# Altium schematic sheet coils.SchDoc
size A
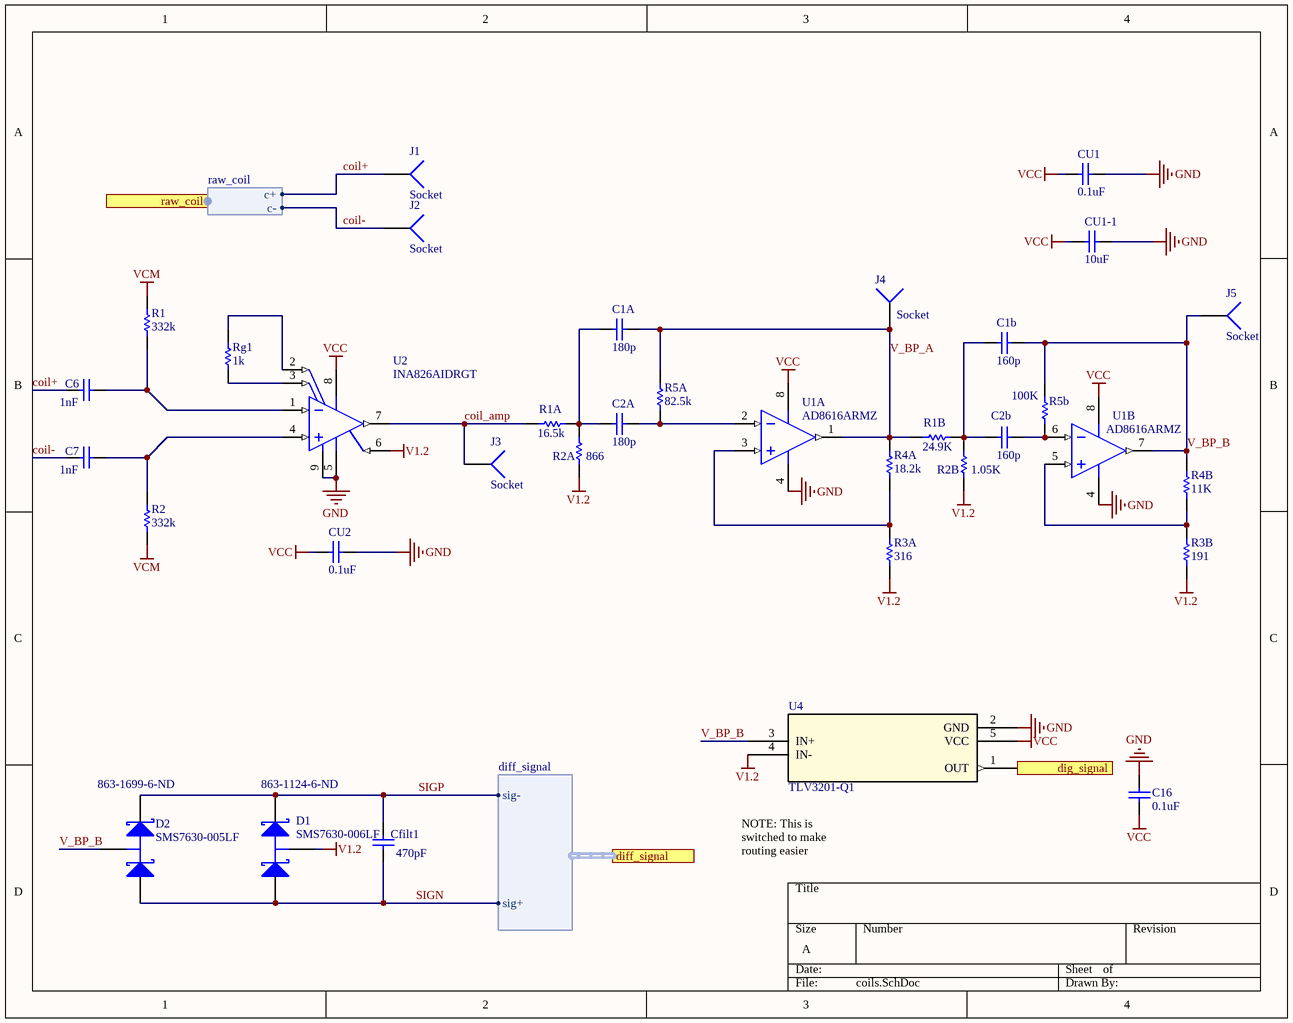
[diagram p0: coils.SchDoc]

## Parts
C1A  value 180p  [0402]  (hidden comment: Cap)
C1b  value 160p  [0402]  (hidden comment: Cap)
C2A  value 180p  [0402]  (hidden comment: Cap)
C2b  value 160p  [0402]  (hidden comment: Cap)
C6  value 1nF  [0402]  (hidden comment: Cap)
C7  value 1nF  [0402]  (hidden comment: Cap)
C16  value 0.1uF  [0402]  (hidden comment: Cap)
Cfilt1  value 470pF  [0402]  (hidden comment: Cap)
CU1  value 0.1uF  [0402]  (hidden comment: Cap)
CU1-1  value 10uF  [0402]  (hidden comment: Cap)
CU2  value 0.1uF  [0402]  (hidden comment: Cap)
D1  SMS7630-006LF  Supplier Part Number 1: 863-1124-6-ND  [SOT23-3N]
D2  SMS7630-005LF  Supplier Part Number 1: 863-1699-6-ND  [SOT23-3N]
J1  Socket  [pin1]
J2  Socket  [pin1]
J3  Socket  [pin1]
J4  Socket  [pin1]
J5  Socket  [pin1]
R1  value 332k  [0402]  (hidden comment: Res)
R1A  value 16.5k  [0402]  (hidden comment: Res)
R1B  value 24.9K  [0402]  (hidden comment: Res)
R2  value 332k  [0402]  (hidden comment: Res)
R2A  value 866  [0402]  (hidden comment: Res)
R2B  value 1.05K  [0402]  (hidden comment: Res)
R3A  value 316  [0402]  (hidden comment: Res)
R3B  value 191  [0402]  (hidden comment: Res)
R4A  value 18.2k  [0402]  (hidden comment: Res)
R4B  value 11K  [0402]  (hidden comment: Res)
R5A  value 82.5k  [0402]  (hidden comment: Res)
R5b  value 100K  [0402]  (hidden comment: Res)
Rg1  value 1k  [0402]  (hidden comment: Res)
U1  AD8616ARMZ  [ADI-RM-8_N]  (parts A,B of 2)
U2  INA826AIDRGT  [DRG0008A_V]
U4  TLV3201-Q1  [SOT95P280X145-5N]

## Ports
diff_signal (harness diff_signal), dig_signal (out), raw_coil (harness raw_coil)

## Harnesses
raw_coil: c-, c+
diff_signal: sig+, sig-

## Nets
GND: C16.2 CU1.1 CU1-1.1 CU2.1 U1.4(-V) U2.5(VS-) U2.9(EP) U4.2(GND)
V1.2: D1.3(C) R2A.1 R2B.1 R3A.2 R3B.1 U2.6(REF) U4.4(IN-)
VCC: C16.1 CU1.2 CU1-1.2 CU2.2 U1.8(+V) U2.8(VS+) U4.5(VCC)
VCM: R1.2 R2.1
coil+: C6.1 J1.1 ; port raw_coil.c+
coil-: C7.1 J2.1 ; port raw_coil.c-
coil_amp: J3.1 R1A.1 U2.7(VOUT)
dig_signal: U4.1(OUT) ; port dig_signal
SIGN: Cfilt1.1 D1.2(K) D2.1(A) ; port diff_signal.sig+
SIGP: Cfilt1.2 D1.1(A) D2.2(K) ; port diff_signal.sig-
V_BP_A: C1A.2 J4.1 R1B.1 R4A.1 R5A.1 U1.1(OUT_A)
V_BP_B: C1b.2 D2.3(C) J5.1 R4B.2 R5b.1 U1.7(OUT_B) U4.3(IN+)
NetC1A_1: C1A.1 C2A.1 R1A.2 R2A.2
NetC1b_1: C1b.1 C2b.1 R1B.2 R2B.2
NetC2A_2: C2A.2 R5A.2 U1.2(-IN_A)
NetC2b_2: C2b.2 R5b.2 U1.6(-IN_B)
NetC6_2: C6.2 R1.1 U2.1(IN-)
NetC7_2: C7.2 R2.2 U2.4(IN+)
NetR3A_1: R3A.1 R4A.2 U1.3(+IN_A)
NetR3B_2: R3B.2 R4B.1 U1.5(+IN_B)
NetRg1_1: Rg1.1 U2.2(RG)
NetRg1_2: Rg1.2 U2.3(RG)

## Notes on the sheet
- (near U4) NOTE: This is switched to make routing easier

## Library data of the parts
C1A C1b C2A C2b C6 C7 C16 Cfilt1 CU1 CU1-1 CU2 = Cap: Ceramic Capacitor (Surface Mount); Manufacturer: Generic Ceramic Chip Cap (TBD)
  C1A C1b C2A C2b C16 Cfilt1 CU1 CU1-1 CU2: Digi-Key Part Number: *; Manufacturer Part Number: *; Note: *; Rating: *
D1 = SMS7621-006LF: Supplier 1: Digi-Key
D2 = SMS7621-005LF: Supplier 1: Digi-Key
R1 R1A R1B R2 R2A R2B R3A R3B R4A R4B R5A R5b Rg1 = Res: Chip Resistor (Surface Mount); Manufacturer: Generic Chip Res (TBD); Manufacturer Part Number: *; Digi-Key Part Number: *; Rating: *
U1 = CMP-0384-01709-1: Double Channel Wide Bandwidth Operational Amplifier, 24 MHz BW, 12 V/us SR, Industrial, 8-pin SOP (RM-8), Tube; Generic Part Number: AD8616; Manufacturer: Analog Devices; Amplifiers Per Package: 2; Small Signal Bandwidth: 24MHz; Input Offset Voltage: 23uV; Input Bias Current: 200fA; V Span Min: 2.7V; Iq/Amp: 2mA; Slew Rate: 12V/us; V Span Max: 6V; PackageDescription: 8-Pin Mini Small Outline Package, Body 3 x 3 mm, Pitch 0.65 mm; PartNumber: AD8616ARMZ; ComponentLink2URL: http://www.analog.com/static/imported-files/data_sheets/AD8615_8616_8618.pdf; ComponentLink3URL: http://www.analog.com/static/imported-files/packages/PKG_PDF/MSOP%28RM%29/RM_8.pdf; PackageReference: RM-8; Mounting Technology: Surface Mount; Code_JEDEC: MO-187-AA; ComponentLink1Description: Manufacturer URL; ComponentLink2Description: Datasheet; ComponentLink3Description: Package Specification; ComponentLink1URL: http://www.analog.com/en/index.html; DatasheetVersion: Rev. E; PartId: 1
U2 = CMP-0944-00099-2: Precision, 200-uA Supply Current, 36-V Supply Instrumentation Amplifier, -40 to 125 degC, 8-pin SON (DRG8), Green (RoHS & no Sb/Br); Manufacturer: Texas Instruments; Input Offset Drift (+/-)(Max)(uV/Degrees Celsius): 2; CMRR(Min)(dB): 84; Quiescent Current (+/-)(Typ)(mA): 0.2; Input Offset (+/-)(Max)(uV): 150; Output Offset Drift (+/-)(Max)(uV/Degrees Celsius): 10; Vs(Max)(V): 36; Non-Linearity (+/-)(Max)(%): 0.0005; Input Bias Current (+/-)(Max)(nA): 65; Number of Channels: 1; Noise at 1kHz(Typ)(nV/rt(Hz)): 18; SubFamily: Single Supply; Output Offset (+/-)(Max)(uV): 700; Gain(V/V): 1 to 1000; Vs(Min)(V): 2.7; PartNumber: INA826AIDRGT; PackageVersion: 4205379/C, 12/2010; DatasheetVersion: SBOS562E; Eco-Plan: Green (RoHS & no Sb/Br); Code_JEDEC: MO-229; ComponentLink2Description: Datasheet; ComponentLink3URL: http://www.ti.com/litv/pdf/mpds151b; ComponentLink2URL: http://www.ti.com/general/docs/lit/getliterature.tsp?genericPartNumber=INA826&fileType=pdf; Mounting Technology: Surface Mount; PackageReference: DRG0008A; PackageDescription: 8-Pin Plastic Small Outline, Body 3 x 3 mm, Pitch 0.5 mm; ComponentLink1Description: Manufacturer URL; ComponentLink1URL: http://www.ti.com/; ComponentLink3Description: Package Specification
U4 = TLV3201-Q1: 40-ns, Micropower Comparator; Supplier 1: Digi-Key; Supplier Part Number 1: 296-36750-1-ND
J1-J5 = Socket: LatestRevisionDate: 17-Jul-2002; LatestRevisionNote: Re-released for DXP Platform.; Publisher: Altium Limited